# Altium schematic sheet P1.1-worcv.SchDoc
size A2
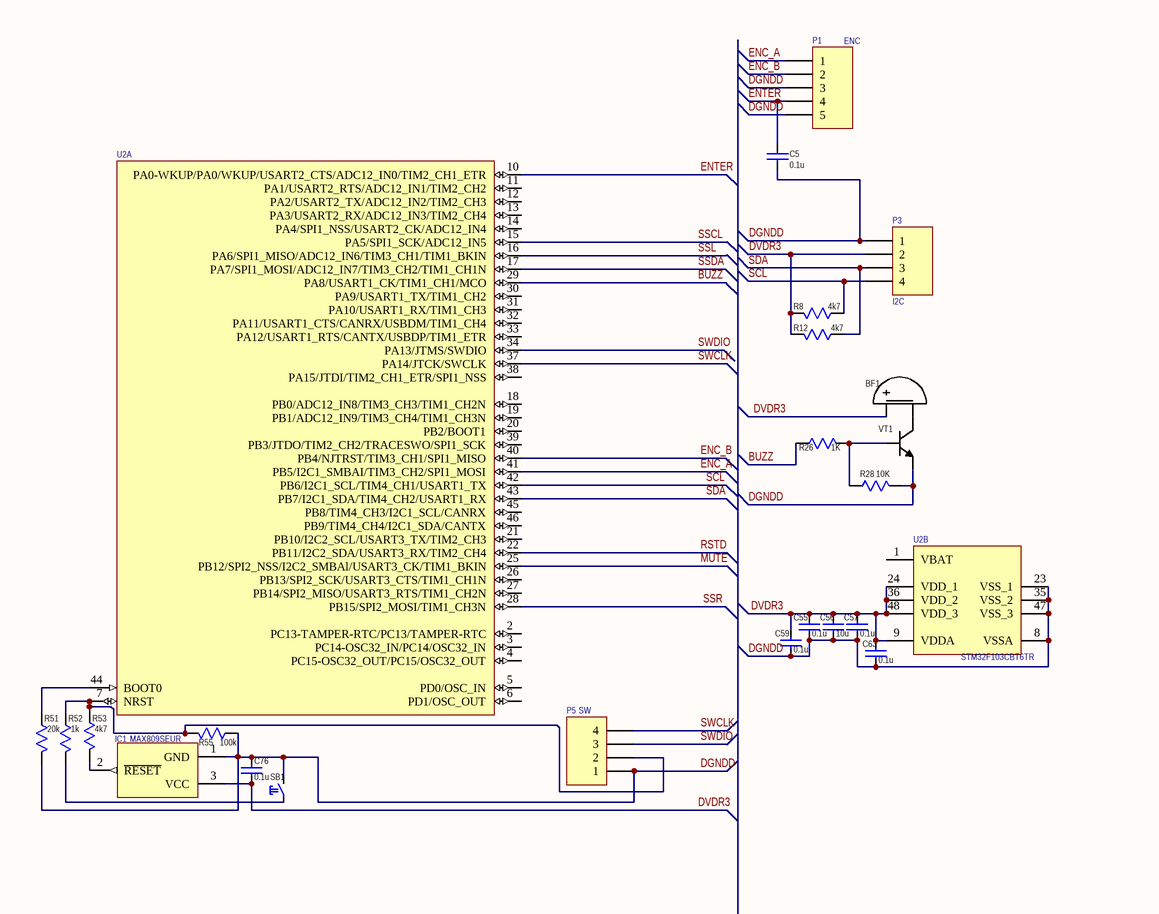
[diagram p0: P1.1-worcv.SchDoc, left]
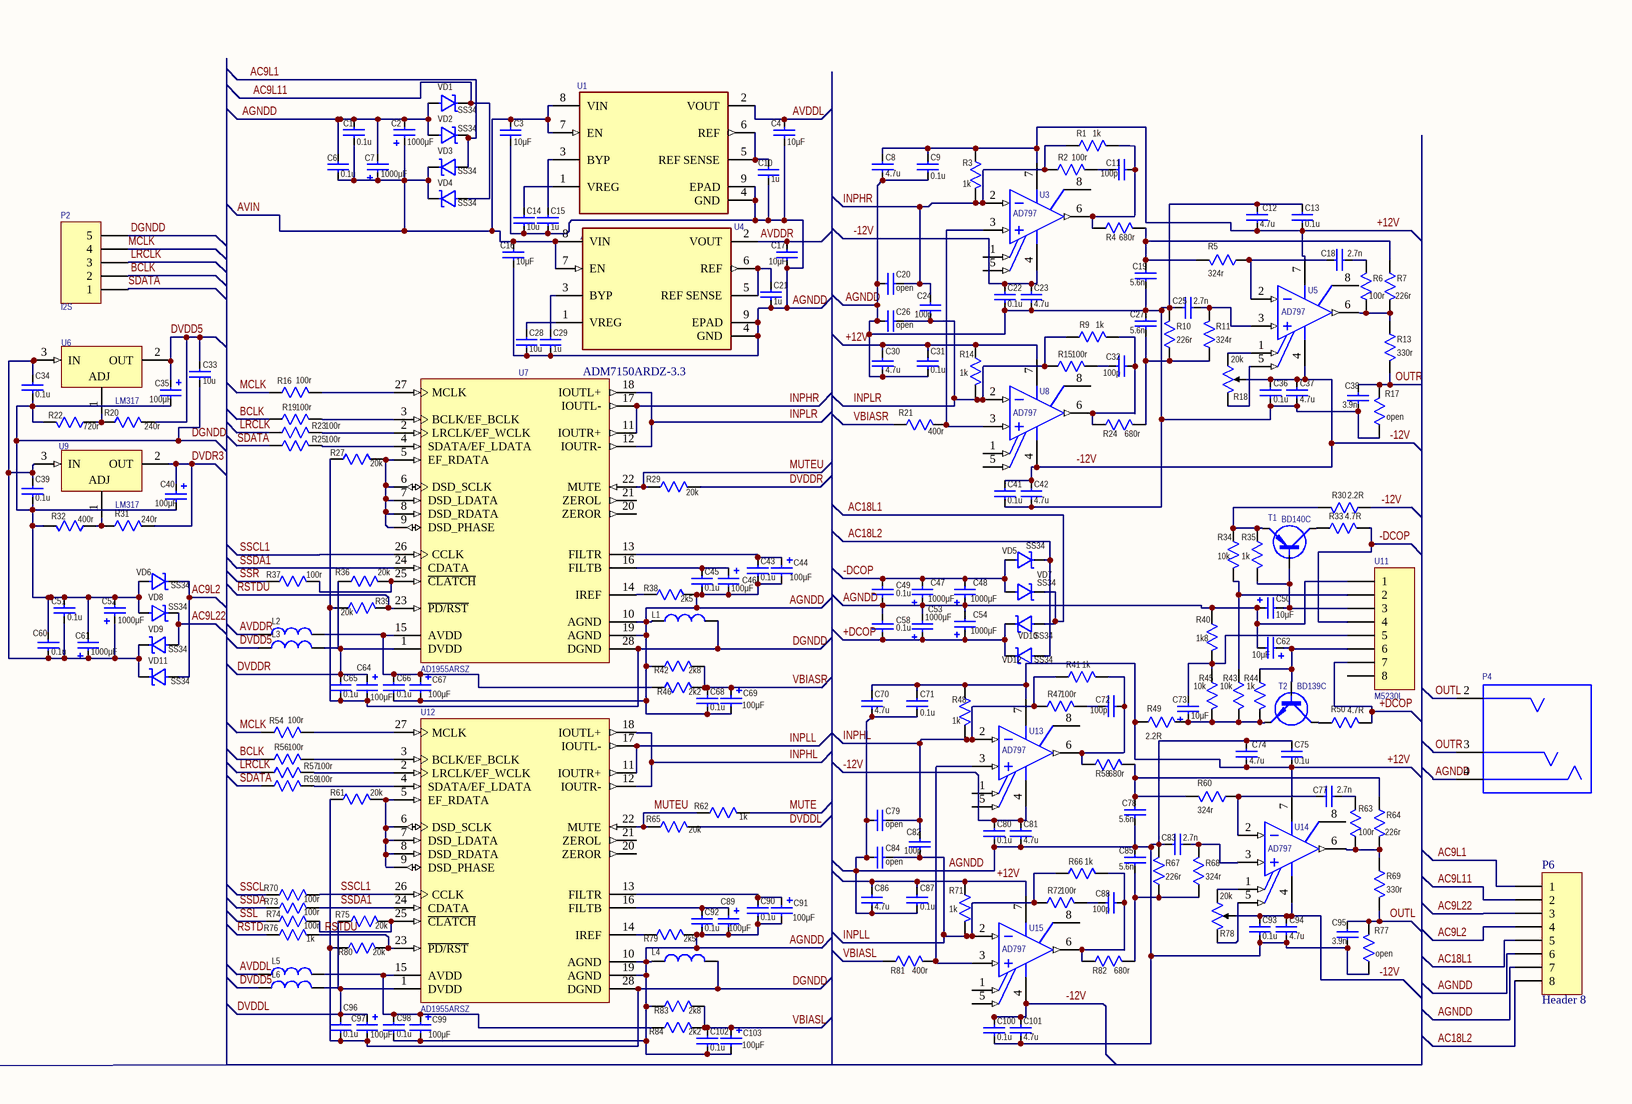
[diagram p1: P1.1-worcv.SchDoc, right]

## Parts
BF1  (no value)  [BUZ: AT-0927-TT-6-R]
C1  value 0.1u  [CAP: 0805]
C2  value 1000μF  [CAP: D10C5H20]
C3  value 10μF  [CAP: 0805]
C4  value 10μF  [CAP: 0805]
C5  value 0.1u  [CAP: 0603]
C6  value 0.1u  [CAP: 0805]
C7  value 1000μF  [CAP: D10C5H20]
C8  value 4.7u  [CAP: 0603]
C9  value 0.1u  [CAP: 0603]
C10  value 1u  [CAP: 0603]
C11  value 100p  [CAP: 0603]
C12  value 4.7u  [CAP: 0603]
C13  value 0.1u  [CAP: 0603]
C14  value 10u  [CAP: 0603]
C15  value 1u  [CAP: 0603]
C16  value 10μF  [CAP: 0805]
C17  value 10μF  [CAP: 0805]
C18  value 2.7n  [CAP: 0603]
C19  value 5.6n  [CAP: 0603]
C20  value open  [CAP: 0603]
C21  value 1u  [CAP: 0603]
C22  value 0.1u  [CAP: 0603]
C23  value 4.7u  [CAP: 0603]
C24  value 100p  [CAP: 0603]
C25  value 2.7n  [CAP: 0603]
C26  value open  [CAP: 0603]
C27  value 5.6n  [CAP: 0603]
C28  value 10u  [CAP: 0603]
C29  value 1u  [CAP: 0603]
C30  value 4.7u  [CAP: 0603]
C31  value 0.1u  [CAP: 0603]
C32  value 100p  [CAP: 0603]
C33  value 10u  [CAP: 0603]
C34  value 0.1u  [CAP: 0805]
C35  value 100μF  [CAP: D6.3C2.5H11]
C36  value 0.1u  [CAP: 0603]
C37  value 4.7u  [CAP: 0603]
C38  value 3.9n  [CAP: 0603]
C39  value 0.1u  [CAP: 0805]
C40  value 100μF  [CAP: D6.3C2.5H11]
C41  value 0.1u  [CAP: 0603]
C42  value 4.7u  [CAP: 0603]
C43  value 0.1u  [CAP: 0603]
C44  value 100μF  [CAP: D6.3C2.5H11]
C45  value 0.1u  [CAP: 0603]
C46  value 100μF  [CAP: D6.3C2.5H11]
C47  value 1000μF  [CAP: D10C5H20]
C48  value 1000μF  [CAP: D10C5H20]
C49  value 0.1u  [CAP: 0805]
C50  value 10μF  [CAP: D5C2H11]
C51  value 0.1u  [CAP: 0805]
C52  value 1000μF  [CAP: D10C5H20]
C53  value 1000μF  [CAP: D10C5H20]
C54  value 1000μF  [CAP: D10C5H20]
C55  value 0.1u  [CAP: 0603]
C56  value 10u  [CAP: 0603]
C57  value 0.1u  [CAP: 0603]
C58  value 0.1u  [CAP: 0805]
C59  value 0.1u  [CAP: 0603]
C60  value 0.1u  [CAP: 0805]
C61  value 1000μF  [CAP: D10C5H20]
C62  value 10μF  [CAP: D5C2H11]
C63  value 0.1u  [CAP: 0603]
C64  value 100μF  [CAP: D6.3C2.5H11]
C65  value 0.1u  [CAP: 0603]
C66  value 0.1u  [CAP: 0603]
C67  value 100μF  [CAP: D6.3C2.5H11]
C68  value 0.1u  [CAP: 0603]
C69  value 100μF  [CAP: D6.3C2.5H11]
C70  value 4.7u  [CAP: 0603]
C71  value 0.1u  [CAP: 0603]
C72  value 100p  [CAP: 0603]
C73  value 10μF  [CAP: D5C2H11]
C74  value 4.7u  [CAP: 0603]
C75  value 0.1u  [CAP: 0603]
C76  value 0.1u  [CAP: 0805]
C77  value 2.7n  [CAP: 0603]
C78  value 5.6n  [CAP: 0603]
C79  value open  [CAP: 0603]
C80  value 0.1u  [CAP: 0603]
C81  value 4.7u  [CAP: 0603]
C82  value 100p  [CAP: 0603]
C83  value 2.7n  [CAP: 0603]
C84  value open  [CAP: 0603]
C85  value 5.6n  [CAP: 0603]
C86  value 4.7u  [CAP: 0603]
C87  value 0.1u  [CAP: 0603]
C88  value 100p  [CAP: 0603]
C89  value 100μF  [CAP: D6.3C2.5H11]
C90  value 0.1u  [CAP: 0603]
C91  value 100μF  [CAP: D6.3C2.5H11]
C92  value 0.1u  [CAP: 0603]
C93  value 0.1u  [CAP: 0603]
C94  value 4.7u  [CAP: 0603]
C95  value 3.9n  [CAP: 0603]
C96  value 0.1u  [CAP: 0603]
C97  value 100μF  [CAP: D6.3C2.5H11]
C98  value 0.1u  [CAP: 0603]
C99  value 100μF  [CAP: D6.3C2.5H11]
C100  value 0.1u  [CAP: 0603]
C101  value 4.7u  [CAP: 0603]
C102  value 0.1u  [CAP: 0603]
C103  value 100μF  [CAP: D6.3C2.5H11]
IC1  MAX809SEUR  [SOT95P230X112-3N]
L1  (no value)  [IND: 0805]
L2  (no value)  [IND: 0805]
L3  (no value)  [IND: 0805]
L4  (no value)  [IND: 0805]
L5  (no value)  [IND: 0805]
L6  (no value)  [IND: 0805]
P1  ENC  [HDR1X5]
P2  I2S  [HDR1X5]
P3  I2C  [HDR1X4]
P4  SJ2-3573A2-SMT-TR  [CUI_SJ2-3573A2-SMT-TR]  (value not drawn)
P5  SW  [HDR1X4]
P6  Header 8  [HDR1X8]
R1  value 1k  [RES: 0603]
R2  value 100r  [RES: 0603]
R3  value 1k  [RES: 0603]
R4  value 680r  [RES: 0603]
R5  value 324r  [RES: 0603]
R6  value 100r  [RES: 0603]
R7  value 226r  [RES: 0603]
R8  value 4k7  [RES: 0603]
R9  value 1k  [RES: 0603]
R10  value 226r  [RES: 0603]
R11  value 324r  [RES: 0603]
R12  value 4k7  [RES: 0603]
R13  value 330r  [RES: 0603]
R14  value 1k  [RES: 0603]
R15  value 100r  [RES: 0603]
R16  value 100r  [RES: 0603]
R17  value open  [RES: 0603]
R18  value 20k  [RES: 3296W]
R19  value 100r  [RES: 0603]
R20  value 240r  [RES: 0603]
R21  value 400r  [RES: 0603]
R22  value 720r  [RES: 0603]
R23  value 100r  [RES: 0603]
R24  value 680r  [RES: 0603]
R25  value 100r  [RES: 0603]
R26  value 1K  [RES: 0603]
R27  value 20k  [RES: 0603]
R28  value 10K  [RES: 0603]
R29  value 20k  [RES: 0603]
R30  value 2.2R  [RES: 1206]
R31  value 240r  [RES: 0603]
R32  value 400r  [RES: 0603]
R33  value 4.7R  [RES: 1206]
R34  value 10k  [RES: 0603]
R35  value 1k  [RES: 0603]
R36  value 20k  [RES: 0603]
R37  value 100r  [RES: 0603]
R38  value 2k5  [RES: 0603]
R39  value 20k  [RES: 0603]
R40  value 1k8  [RES: 0603]
R41  value 1k  [RES: 0603]
R42  value 2k8  [RES: 0603]
R43  value 10k  [RES: 0603]
R44  value 1k  [RES: 0603]
R45  value 10k  [RES: 0603]
R46  value 2k2  [RES: 0603]
R47  value 100r  [RES: 0603]
R48  value 1k  [RES: 0603]
R49  value 2.2R  [RES: 1206]
R50  value 4.7R  [RES: 1206]
R51  value 20k  [RES: 0603]
R52  value 1k  [RES: 0603]
R53  value 4k7  [RES: 0603]
R54  value 100r  [RES: 0603]
R55  value 100k  [RES: 0603]
R56  value 100r  [RES: 0603]
R57  value 100r  [RES: 0603]
R58  value 680r  [RES: 0603]
R59  value 100r  [RES: 0603]
R60  value 324r  [RES: 0603]
R61  value 20k  [RES: 0603]
R62  value 1k  [RES: 0603]
R63  value 100r  [RES: 0603]
R64  value 226r  [RES: 0603]
R65  value 20k  [RES: 0603]
R66  value 1k  [RES: 0603]
R67  value 226r  [RES: 0603]
R68  value 324r  [RES: 0603]
R69  value 330r  [RES: 0603]
R70  value 100r  [RES: 0603]
R71  value 1k  [RES: 0603]
R72  value 100r  [RES: 0603]
R73  value 100r  [RES: 0603]
R74  value 100r  [RES: 0603]
R75  value 20k  [RES: 0603]
R76  value 1k  [RES: 0603]
R77  value open  [RES: 0603]
R78  value 20k  [RES: 3296W]
R79  value 2k5  [RES: 0603]
R80  value 20k  [RES: 0603]
R81  value 400r  [RES: 0603]
R82  value 680r  [RES: 0603]
R83  value 2k8  [RES: 0603]
R84  value 2k2  [RES: 0603]
SB1  (no value)  [BUT: 6x6 SMD]
T1  BD140C  [TO126V A]
T2  BD139C  [TO126V A]
U1  ADM7150ARDZ-3.3  [Analog_Devices_Inc_RD-8-2_0]  (value not drawn)
U2  (no value)  [QFP50P900X900X160-48N]  (parts A,B of 2)
U3  AD797  [ADI-R-8_M]
U4  ADM7150ARDZ-3.3  [Analog_Devices_Inc_RD-8-2_0]  (value not drawn)
U5  AD797  [ADI-R-8_M]
U6  LM317  [TO-220-V]
U7  AD1955ARSZ  [ADI-RS-28_L]
U8  AD797  [ADI-R-8_M]
U9  LM317  [TO-220-V]
U11  M5230L  [HDR1X8]
U12  AD1955ARSZ  [ADI-RS-28_L]
U13  AD797  [ADI-R-8_M]
U14  AD797  [ADI-R-8_M]
U15  AD797  [ADI-R-8_M]
VD1  PartNumber: SS34  [DIODE: SMA]
VD2  PartNumber: SS34  [DIODE: SMA]
VD3  PartNumber: SS34  [DIODE: SMA]
VD4  PartNumber: SS34  [DIODE: SMA]
VD5  PartNumber: SS34  [DIODE: SMA]
VD6  PartNumber: SS34  [DIODE: SMA]
VD7  PartNumber: SS34  [DIODE: SMA]
VD8  PartNumber: SS34  [DIODE: SMA]
VD9  PartNumber: SS34  [DIODE: SMA]
VD10  PartNumber: SS34  [DIODE: SMA]
VD11  PartNumber: SS34  [DIODE: SMA]
VD12  PartNumber: SS34  [DIODE: SMA]
VT1  (no value)  [SOT23]

## Nets
+12V: C8.1 C9.1 C12.2 C13.2 C30.1 C31.1 C70.1 C71.1 C74.2 C75.2 C86.1 C87.1 R3.1 R14.1 R48.1 R49.1 R71.1 U3.7(+VS) U5.7(+VS) U8.7(+VS) U13.7(+VS) U14.7(+VS) U15.7(+VS)
+DCOP: C53.1 C54.1 C58.1 R50.2 U11.7 VD10.2 VD12.2
-12V: C22.1 C23.1 C36.1 C37.1 C41.1 C42.1 C80.1 C81.1 C93.1 C94.1 C100.1 C101.1 R18.2 R30.1 R78.2 U3.4(-VS) U5.4(-VS) U8.4(-VS) U13.4(-VS) U14.4(-VS) U15.4(-VS)
-DCOP: C47.2 C48.2 C49.2 R33.2 U11.4 VD5.1 VD7.1
AC9L1: P6.1 VD2.2 VD3.1
AC9L2: P6.4 VD6.2 VD11.1
AC9L11: P6.2 VD1.2 VD4.1
AC9L22: P6.3 VD8.2 VD9.1
AC18L1: P6.5 VD7.2 VD10.1
AC18L2: P6.8 VD5.2 VD12.1
AGNDD: C1.2 C2.2 C3.2 C4.2 C6.2 C7.2 C8.2 C9.2 C10.2 C12.1 C13.1 C14.2 C15.2 C16.2 C17.2 C19.2 C20.2 C21.2 C22.2 C23.2 C25.1 C26.2 C27.1 C28.2 C29.2 C30.2 C31.2 C36.2 C37.2 C38.1 C41.2 C42.2 C43.2 C44.2 C45.2 C46.2 C47.1 C48.1 C49.1 C50.1 C53.2 C54.2 C58.2 C62.2 C66.2 C67.2 C68.2 C69.2 C70.2 C71.2 C74.1 C75.1 C78.2 C79.2 C80.2 C81.2 C83.1 C84.2 C85.1 C86.2 C87.2 C89.2 C90.2 C91.2 C92.2 C93.2 C94.2 C95.1 C98.2 C99.2 C100.2 C101.2 C102.2 C103.2 L1.2 L4.2 P4.4(RING2) P6.6 P6.7 R10.2 R17.1 R38.2 R40.1 R42.1 R67.2 R77.1 R79.2 R83.1 U1.4(GND) U1.9(EPAD) U4.4(GND) U4.9(EPAD) U7.10(AGND) U7.19(AGND) U11.1 U12.10(AGND) U12.19(AGND) VD1.1 VD2.1
AVDDL: C4.1 L5.2 U1.2(VOUT)
AVDDR: C17.1 L2.2 U4.2(VOUT)
AVIN: C1.1 C2.1 C3.1 C6.1 C7.1 C16.1 U1.7(EN) U1.8(VIN) U4.7(EN) U4.8(VIN) VD3.2 VD4.2
BCLK: P2.2 R19.1 R56.1
BUZZ: R26.1 U2.29(PA8/USART1_CK/TIM1_CH1/MCO)
DGNDD: C5.2 C33.2 C34.1 C35.2 C39.1 C40.2 C51.2 C52.2 C55.1 C56.2 C57.1 C59.1 C60.2 C61.2 C63.1 C64.2 C65.2 C76.2 C96.2 C97.2 IC1.1(GND) L1.1 L4.1 P1.3 P1.5 P2.5 P3.1 P5.1 R22.2 R27.1 R28.2 R32.2 R39.1 R51.2 R55.1 R61.1 R80.1 SB1.2 U2.8(VSSA) U2.23(VSS_1) U2.35(VSS_2) U2.47(VSS_3) U7.28(DGND) U12.28(DGND) VD6.1 VD8.1 VT1.2(E)
DVDD5: C33.1 C35.1 L3.2 L6.2 R20.2 U6.2(OUT)
DVDDL: C96.1 C97.1 L6.1 R65.2 R75.1 U12.1(DVDD)
DVDDR: C64.1 C65.1 L3.1 R29.2 R36.1 U7.1(DVDD)
DVDR3: BF1.1(+) C40.1 C55.2 C56.1 C57.2 C59.2 C63.2 C76.1 IC1.3(VCC) P3.2 R8.2 R12.2 R31.2 U2.9(VDDA) U2.24(VDD_1) U2.36(VDD_2) U2.48(VDD_3) U9.2(OUT)
ENC_A: P1.1 U2.41(PB5/I2C1_SMBAI/TIM3_CH2/SPI1_MOSI)
ENC_B: P1.2 U2.40(PB4/NJTRST/TIM3_CH1/SPI1_MISO)
ENTER: C5.1 P1.4 U2.10(PA0-WKUP/PA0/WKUP/USART2_CTS/ADC12_IN0/TIM2_CH1_ETR)
INPHL: C79.1 C82.2 R41.1 R47.1 R48.2 U12.12(IOUTR-) U12.18(IOUTL+) U13.2(-IN)
INPHR: C20.1 C24.2 R1.1 R2.1 R3.2 U3.2(-IN) U7.11(IOUTR+) U7.17(IOUTL-)
INPLL: C82.1 C84.1 R66.1 R71.2 R72.1 U12.11(IOUTR+) U12.17(IOUTL-) U15.2(-IN)
INPLR: C24.1 C26.1 R9.1 R14.2 R15.1 U7.12(IOUTR-) U7.18(IOUTL+) U8.2(-IN)
LRCLK: P2.3 R23.1 R57.1
MCLK: P2.4 R16.1 R54.1
MUTE: R62.2 U2.25(PB12/SPI2_NSS/I2C2_SMBAl/USART3_CK/TIM1_BKIN)
MUTEU: R29.1 R62.1 R65.1 U7.22(MUTE) U12.22(MUTE)
OUTL: C95.2 P4.2(TIP) R69.2 R77.2
OUTR: C38.2 P4.3(RING1) R13.2 R17.2
RSTD: R76.1 U2.22(PB11/I2C2_SDA/USART3_RX/TIM2_CH4)
RSTDU: R39.2 R76.2 R80.2 U7.23(~{PD/RST}) U12.23(~{PD/RST})
SCL: P3.4 R8.1 U2.42(PB6/I2C1_SCL/TIM4_CH1/USART1_TX)
SDA: P3.3 R12.1 U2.43(PB7/I2C1_SDA/TIM4_CH2/USART1_RX)
SDATA: P2.1 R25.1 R59.1
SSCL: R70.1 U2.15(PA5/SPI1_SCK/ADC12_IN5)
SSCL1: R70.2 U7.26(CCLK) U12.26(CCLK)
SSDA: R73.1 U2.17(PA7/SPI1_MOSI/ADC12_IN7/TIM3_CH2/TIM1_CH1N)
SSDA1: R73.2 U7.24(CDATA) U12.24(CDATA)
SSL: R74.1 U2.16(PA6/SPI1_MISO/ADC12_IN6/TIM3_CH1/TIM1_BKIN)
SSR: R37.1 U2.28(PB15/SPI2_MOSI/TIM1_CH3N)
SWCLK: P5.4 U2.37(PA14/JTCK/SWCLK)
SWDIO: P5.3 U2.34(PA13/JTMS/SWDIO)
VBIASL: C102.1 C103.1 R81.1 R83.2 R84.2
VBIASR: C68.1 C69.1 R21.1 R42.2 R46.2
NetBF1_2: BF1.2(-) VT1.3(C)
NetC10_1: C10.1 U1.5(REF_SENSE) U1.6(REF)
NetC11_1: C11.1 R1.2 R4.1 U3.6(OUT)
NetC11_2: C11.2 R2.2
NetC14_1: C14.1 U1.1(VREG)
NetC15_1: C15.1 U1.3(BYP)
NetC18_1: C18.1 R5.1 U5.2(-IN)
NetC18_2: C18.2 R6.2
NetC19_1: C19.1 R4.2 R5.2 R7.1
NetC21_1: C21.1 U4.5(REF_SENSE) U4.6(REF)
NetC25_2: C25.2 R11.2 U5.3(+IN)
NetC27_2: C27.2 R10.1 R11.1 R24.2
NetC28_1: C28.1 U4.1(VREG)
NetC29_1: C29.1 U4.3(BYP)
NetC32_1: C32.1 R9.2 R24.1 U8.6(OUT)
NetC32_2: C32.2 R15.2
NetC34_2: C34.2 C39.2 C51.1 C52.1 C60.1 C61.1 U6.3(IN) U9.3(IN) VD9.2 VD11.2
NetC43_1: C43.1 C44.1 U7.13(FILTR)
NetC45_1: C45.1 C46.1 U7.16(FILTB)
NetC50_2: C50.2 R35.2 T1.3(B) U11.3
NetC62_1: C62.1 R44.1 T2.3(B) U11.6
NetC66_1: C66.1 C67.1 L2.1 R46.1 U7.15(AVDD)
NetC72_1: C72.1 R41.2 R58.1 U13.6(OUT)
NetC72_2: C72.2 R47.2
NetC73_1: C73.1 R43.2 R44.2 R45.2 R49.2 T2.1(E)
NetC73_2: C73.2 R40.2 R45.1 U11.5
NetC77_1: C77.1 R60.1 U14.2(-IN)
NetC77_2: C77.2 R63.2
NetC78_1: C78.1 R58.2 R60.2 R64.1
NetC83_2: C83.2 R68.2 U14.3(+IN)
NetC85_2: C85.2 R67.1 R68.1 R82.2
NetC88_1: C88.1 R66.2 R82.1 U15.6(OUT)
NetC88_2: C88.2 R72.2
NetC89_1: C89.1 C92.1 U12.16(FILTB)
NetC90_1: C90.1 C91.1 U12.13(FILTR)
NetC98_1: C98.1 C99.1 L5.1 R84.1 U12.15(AVDD)
NetIC1_2: IC1.2(~{RESET}) R53.2
NetP5_2: P5.2 R52.1 R53.1 R55.2 U2.7(NRST)
NetR6_1: R6.1 R7.2 R13.1 U5.6(OUT)
NetR16_2: R16.2 U7.27(MCLK)
NetR18_1: R18.1 U5.1(OFFSET_NULL)
NetR18_3: R18.3 U5.5(OFFSET_NULL)
NetR19_2: R19.2 U7.3(BCLK/EF_BCLK)
NetR20_1: R20.1 R22.1 U6.1(ADJ)
NetR21_2: R21.2 U3.3(+IN) U8.3(+IN)
NetR23_2: R23.2 U7.2(LRCLK/EF_WCLK)
NetR25_2: R25.2 U7.4(SDATA/EF_LDATA)
NetR26_2: R26.2 R28.1 VT1.1(B)
NetR27_2: R27.2 U7.5(EF_RDATA) U7.6(DSD_SCLK) U7.7(DSD_LDATA) U7.8(DSD_RDATA) U7.9(DSD_PHASE)
NetR30_2: R30.2 R34.1 R35.1 T1.1(E)
NetR31_1: R31.1 R32.1 U9.1(ADJ)
NetR33_1: R33.1 T1.2(C)
NetR34_2: R34.2 R43.1 U11.2
NetR36_2: R36.2 R37.2 U7.25(~{CLATCH})
NetR38_1: R38.1 U7.14(IREF)
NetR50_1: R50.1 T2.2(C)
NetR51_1: R51.1 U2.44(BOOT0)
NetR52_2: R52.2 SB1.1
NetR54_2: R54.2 U12.27(MCLK)
NetR56_2: R56.2 U12.3(BCLK/EF_BCLK)
NetR57_2: R57.2 U12.2(LRCLK/EF_WCLK)
NetR59_2: R59.2 U12.4(SDATA/EF_LDATA)
NetR61_2: R61.2 U12.5(EF_RDATA) U12.6(DSD_SCLK) U12.7(DSD_LDATA) U12.8(DSD_RDATA) U12.9(DSD_PHASE)
NetR63_1: R63.1 R64.2 R69.1 U14.6(OUT)
NetR74_2: R74.2 R75.2 U12.25(~{CLATCH})
NetR78_1: R78.1 U14.1(OFFSET_NULL)
NetR78_3: R78.3 U14.5(OFFSET_NULL)
NetR79_1: R79.1 U12.14(IREF)
NetR81_2: R81.2 U13.3(+IN) U15.3(+IN)

Not connected (* = marked no-connect by the designer): U2 1(VBAT) 2(PC13-TAMPER-RTC/PC13/TAMPER-RTC) 3(PC14-OSC32_IN/PC14/OSC32_IN) 4(PC15-OSC32_OUT/PC15/OSC32_OUT) 5(PD0/OSC_IN) 6(PD1/OSC_OUT) 11(PA1/USART2_RTS/ADC12_IN1/TIM2_CH2) 12(PA2/USART2_TX/ADC12_IN2/TIM2_CH3) 13(PA3/USART2_RX/ADC12_IN3/TIM2_CH4) 14(PA4/SPI1_NSS/USART2_CK/ADC12_IN4) 18(PB0/ADC12_IN8/TIM3_CH3/TIM1_CH2N) 19(PB1/ADC12_IN9/TIM3_CH4/TIM1_CH3N) 20(PB2/BOOT1) 21(PB10/I2C2_SCL/USART3_TX/TIM2_CH3) 26(PB13/SPI2_SCK/USART3_CTS/TIM1_CH1N) 27(PB14/SPI2_MISO/USART3_RTS/TIM1_CH2N) 30(PA9/USART1_TX/TIM1_CH2) 31(PA10/USART1_RX/TIM1_CH3) 32(PA11/USART1_CTS/CANRX/USBDM/TIM1_CH4) 33(PA12/USART1_RTS/CANTX/USBDP/TIM1_ETR) 38(PA15/JTDI/TIM2_CH1_ETR/SPI1_NSS) 39(PB3/JTDO/TIM2_CH2/TRACESWO/SPI1_SCK) 45(PB8/TIM4_CH3/I2C1_SCL/CANRX) 46(PB9/TIM4_CH4/I2C1_SDA/CANTX); U3 1(OFFSET_NULL) 5(OFFSET_NULL) 8(DECOMPENSATION_AND_DISTORTION_NEUTRALIZATION); U5 8(DECOMPENSATION_AND_DISTORTION_NEUTRALIZATION); U7 20(ZEROR) 21(ZEROL); U8 1(OFFSET_NULL) 5(OFFSET_NULL) 8(DECOMPENSATION_AND_DISTORTION_NEUTRALIZATION); U11 8; U12 20(ZEROR) 21(ZEROL); U13 1(OFFSET_NULL) 5(OFFSET_NULL) 8(DECOMPENSATION_AND_DISTORTION_NEUTRALIZATION); U14 8(DECOMPENSATION_AND_DISTORTION_NEUTRALIZATION); U15 1(OFFSET_NULL) 5(OFFSET_NULL) 8(DECOMPENSATION_AND_DISTORTION_NEUTRALIZATION)

## Library data of the parts
BF1 = Buzzer: Manufacturer: PUI Audio; ValueManufacturerPartNumber: DIP switch, 2.73 kHz, 3VDC, 80mA, -20...+70°C; PartNumber: AT-0927-TT-6-R; TypeBuzzer: DIP switch; VoltageMax: 3VDC; Frequency: 2.73 kHz; CurrentMax: 80mA; HelpURL: https://www.digikey.com/products/en?keywords=AT-0927-TT-6-R; Temperature: -20...+70°C
C1 C5 C6 C9 C13 C22 C31 C34 C36 C39 C41 C43 C45 C49 C51 C55 C57-C60 C63 C65 C66 C68 C71 C75 C76 C80 C87 C90 C92 C93 C96 C98 C100 C102 = Ceramic: Manufacturer: Yageo; PartNumber: CC0201KRX7R7BB103; ValueManufacturerPartNumber: Ceramic capacitor, 0.1u, X7R, ±10%, 16V, 0201, -55...+125°C; TypeCapacitor: Ceramic capacitor; Tolerance: ±10%; TypeDielectric: X7R; Voltage: 16V; Package: 0201; HelpURL: https://www.digikey.com/product-detail/en/yageo/CC0201KRX7R7BB103/311-1404-1-ND/2833710; Temperature: -55...+125°C
C2 C7 C47 C48 C52-C54 C61 = Aluminium: Manufacturer: Wurth; PartNumber: 860080475013; ValueManufacturerPartNumber: Aluminium capacitor, 1000μF, 35V, ±20%, 54mOhm, 14x10x5 mm, -55...+105°C; TypeCapacitor: Aluminium capacitor; Tolerance: ±20%; Impedance: 54mOhm; Voltage: 35V; Package: 14x10x5 mm; HelpURL: https://www.digikey.com/product-detail/en/wurth-electronics-inc/860080475013/732-9029-1-ND/5728972; Temperature: -55...+105°C
C3 C4 C16 C17 = Ceramic: Manufacturer: Yageo; PartNumber: CC0201KRX7R7BB103; ValueManufacturerPartNumber: Ceramic capacitor, 10μF, X7R, ±10%, 16V, 0201, -55...+125°C; TypeCapacitor: Ceramic capacitor; Tolerance: ±10%; TypeDielectric: X7R; Voltage: 16V; Package: 0201; HelpURL: https://www.digikey.com/product-detail/en/yageo/CC0201KRX7R7BB103/311-1404-1-ND/2833710; Temperature: -55...+125°C
C8 C12 C23 C30 C37 C42 C70 C74 C81 C86 C94 C101 = Ceramic: Manufacturer: Yageo; PartNumber: CC0201KRX7R7BB103; ValueManufacturerPartNumber: Ceramic capacitor, 4.7u, X7R, ±10%, 16V, 0201, -55...+125°C; TypeCapacitor: Ceramic capacitor; Tolerance: ±10%; TypeDielectric: X7R; Voltage: 16V; Package: 0201; HelpURL: https://www.digikey.com/product-detail/en/yageo/CC0201KRX7R7BB103/311-1404-1-ND/2833710; Temperature: -55...+125°C
C10 C15 C21 C29 = Ceramic: Manufacturer: Yageo; PartNumber: CC0201KRX7R7BB103; ValueManufacturerPartNumber: Ceramic capacitor, 1u, X7R, ±10%, 16V, 0201, -55...+125°C; TypeCapacitor: Ceramic capacitor; Tolerance: ±10%; TypeDielectric: X7R; Voltage: 16V; Package: 0201; HelpURL: https://www.digikey.com/product-detail/en/yageo/CC0201KRX7R7BB103/311-1404-1-ND/2833710; Temperature: -55...+125°C
C11 C24 C32 C72 C82 C88 = Ceramic: Manufacturer: Yageo; PartNumber: CC0201KRX7R7BB103; ValueManufacturerPartNumber: Ceramic capacitor, 100p, X7R, ±10%, 16V, 0201, -55...+125°C; TypeCapacitor: Ceramic capacitor; Tolerance: ±10%; TypeDielectric: X7R; Voltage: 16V; Package: 0201; HelpURL: https://www.digikey.com/product-detail/en/yageo/CC0201KRX7R7BB103/311-1404-1-ND/2833710; Temperature: -55...+125°C
C14 C28 C33 C56 = Ceramic: Manufacturer: Yageo; PartNumber: CC0201KRX7R7BB103; ValueManufacturerPartNumber: Ceramic capacitor, 10u, X7R, ±10%, 16V, 0201, -55...+125°C; TypeCapacitor: Ceramic capacitor; Tolerance: ±10%; TypeDielectric: X7R; Voltage: 16V; Package: 0201; HelpURL: https://www.digikey.com/product-detail/en/yageo/CC0201KRX7R7BB103/311-1404-1-ND/2833710; Temperature: -55...+125°C
C18 C25 C77 C83 = Ceramic: Manufacturer: Yageo; PartNumber: CC0201KRX7R7BB103; ValueManufacturerPartNumber: Ceramic capacitor, 2.7n, X7R, ±10%, 16V, 0201, -55...+125°C; TypeCapacitor: Ceramic capacitor; Tolerance: ±10%; TypeDielectric: X7R; Voltage: 16V; Package: 0201; HelpURL: https://www.digikey.com/product-detail/en/yageo/CC0201KRX7R7BB103/311-1404-1-ND/2833710; Temperature: -55...+125°C
C19 C27 C78 C85 = Ceramic: Manufacturer: Yageo; PartNumber: CC0201KRX7R7BB103; ValueManufacturerPartNumber: Ceramic capacitor, 5.6n, X7R, ±10%, 16V, 0201, -55...+125°C; TypeCapacitor: Ceramic capacitor; Tolerance: ±10%; TypeDielectric: X7R; Voltage: 16V; Package: 0201; HelpURL: https://www.digikey.com/product-detail/en/yageo/CC0201KRX7R7BB103/311-1404-1-ND/2833710; Temperature: -55...+125°C
C20 C26 C79 C84 = Ceramic: Manufacturer: Yageo; PartNumber: CC0201KRX7R7BB103; ValueManufacturerPartNumber: Ceramic capacitor, open, X7R, ±10%, 16V, 0201, -55...+125°C; TypeCapacitor: Ceramic capacitor; Tolerance: ±10%; TypeDielectric: X7R; Voltage: 16V; Package: 0201; HelpURL: https://www.digikey.com/product-detail/en/yageo/CC0201KRX7R7BB103/311-1404-1-ND/2833710; Temperature: -55...+125°C
C35 C40 C44 C46 C64 C67 C69 C89 C91 C97 C99 C103 = Aluminium: Manufacturer: Wurth; PartNumber: 860080475013; ValueManufacturerPartNumber: Aluminium capacitor, 100μF, 25V, ±20%, 54mOhm, 14x10x5 mm, -55...+105°C; TypeCapacitor: Aluminium capacitor; Tolerance: ±20%; Impedance: 54mOhm; Voltage: 25V; Package: 14x10x5 mm; HelpURL: https://www.digikey.com/product-detail/en/wurth-electronics-inc/860080475013/732-9029-1-ND/5728972; Temperature: -55...+105°C
C38 C95 = Ceramic: Manufacturer: Yageo; PartNumber: CC0201KRX7R7BB103; ValueManufacturerPartNumber: Ceramic capacitor, 3.9n, X7R, ±10%, 16V, 0201, -55...+125°C; TypeCapacitor: Ceramic capacitor; Tolerance: ±10%; TypeDielectric: X7R; Voltage: 16V; Package: 0201; HelpURL: https://www.digikey.com/product-detail/en/yageo/CC0201KRX7R7BB103/311-1404-1-ND/2833710; Temperature: -55...+125°C
C50 C62 C73 = Aluminium: Manufacturer: Wurth; PartNumber: 860080475013; ValueManufacturerPartNumber: Aluminium capacitor, 10μF, 50V, ±20%, 54mOhm, 14x10x5 mm, -55...+105°C; TypeCapacitor: Aluminium capacitor; Tolerance: ±20%; Impedance: 54mOhm; Voltage: 50V; Package: 14x10x5 mm; HelpURL: https://www.digikey.com/product-detail/en/wurth-electronics-inc/860080475013/732-9029-1-ND/5728972; Temperature: -55...+105°C
IC1 = MAX809MEUR: 3-Pin Microprocessor Reset Circuit; Part Description: 3-Pin Microprocessor Reset Circuit (Reset Threshold 4.38V); Manufacturer: MAXIM; PressFit: No; Bonding: No; Part Number: MAX809SEUR; Component Kind: Standard; Component Type: Standard; Device: MAX809SEUR; PackageDescription: SOT23 3-Leads, Pitch 0.95mm - Body 1.3x2.86mm, IPC Medium Density; Manufacturer Part Number: MAX809SEUR; Pin Count: 3; Case: SOT23; Mounted: Yes; Socket: No; SMD: Yes; Sense: No; ComponentHeight: 1.12mm; HelpURL: \\cern.ch\dfs\Applications\Altium\Datasheets\MAX809MEUR.pdf; Author: CERN DEM JLC; CreateDate: 23.08.2012; LatestRevisionDate: 23.08.2012
L1-L6 = Inductor_SMD: Manufacturer: Murata Electronics; PartNumber: LQP03TNR10J02D; ValueManufacturerPartNumber: Fixed inductor, 100nH, ±5%, 0201, 80mA, -55...+125°C; TypeInductor: Fixed inductor; MaxCurrent: 80mA; Tolerance: ±5%; Value: 100nH; Package: 0201; HelpURL: https://www.digikey.com/product-detail/en/murata-electronics-north-america/LQP03TNR10J02D/490-6742-1-ND/3845939; Temperature: -55...+125°C
P1 P2 = Header 5: Header, 5-Pin; LatestRevisionDate: 17-Jul-2002; LatestRevisionNote: Re-released for DXP Platform.; Publisher: Altium Limited
P3 P5 = Header 4: Header, 4-Pin; LatestRevisionDate: 17-Jul-2002; LatestRevisionNote: Re-released for DXP Platform.; Publisher: Altium Limited
P4 = SJ2-3573A2-SMT-TR: 3.5 mm, Stereo, Right Angle, Surface Mount _SMT_, Audio Jack Connector; MF: CUI Devices; Value: *; MP: SJ2-3573A2-SMT-TR; SnapEDA_Link: https://www.snapeda.com/parts/SJ2-3573A2-SMT-TR/CUI%20Devices/view-part/701785/?ref=snap; Package: None; Digi-Key_Part_Number: CP-SJ2-3573A2-SMT-CT-ND; Digi-Key_Purchase_URL: https://www.digikey.com.tr/product-detail/en/cui-devices/SJ2-3573A2-SMT-TR/CP-SJ2-3573A2-SMT-CT-ND/6619610?utm_source=snapeda&utm_medium=aggregator&utm_campaign=symbol; CUI_purchase_URL: https://www.cuidevices.com/product/interconnect/connectors/audio-connectors/jacks/sj2-357x-smt-series?utm_source=snapeda.com&utm_medium=referral&utm_campaign=snapedaBOM
P6 U11 = Header 8: Header, 8-Pin; LatestRevisionDate: 17-Jul-2002; LatestRevisionNote: Re-released for DXP Platform.; Publisher: Altium Limited
R1 R3 R9 R14 R35 R41 R44 R48 R52 R62 R66 R71 R76 = Resistor: Manufacturer: Yageo; PartNumber: RC0201JR-07100RL; ValueManufacturerPartNumber: Resistor film, 1k, ±5%, 0201, 0.05W, -55...+125°C; TypeResistor: Resistor film; Power: 0.05W; Tolerance: ±5%; Package: 0201; HelpURL: https://www.digikey.com/product-detail/en/yageo/RC0201JR-07100RL/311-100NCT-ND/1949006; Temperature: -55...+125°C
R2 R6 R15 R16 R19 R23 R25 R37 R47 R54 R56 R57 R59 R63 R70 R72-R74 = Resistor: Manufacturer: Yageo; PartNumber: RC0201JR-07100RL; ValueManufacturerPartNumber: Resistor film, 100r, ±5%, 0201, 0.05W, -55...+125°C; TypeResistor: Resistor film; Power: 0.05W; Tolerance: ±5%; Package: 0201; HelpURL: https://www.digikey.com/product-detail/en/yageo/RC0201JR-07100RL/311-100NCT-ND/1949006; Temperature: -55...+125°C
R4 R24 R58 R82 = Resistor: Manufacturer: Yageo; PartNumber: RC0201JR-07100RL; ValueManufacturerPartNumber: Resistor film, 680r, ±5%, 0201, 0.05W, -55...+125°C; TypeResistor: Resistor film; Power: 0.05W; Tolerance: ±5%; Package: 0201; HelpURL: https://www.digikey.com/product-detail/en/yageo/RC0201JR-07100RL/311-100NCT-ND/1949006; Temperature: -55...+125°C
R5 R11 R60 R68 = Resistor: Manufacturer: Yageo; PartNumber: RC0201JR-07100RL; ValueManufacturerPartNumber: Resistor film, 324r, ±5%, 0201, 0.05W, -55...+125°C; TypeResistor: Resistor film; Power: 0.05W; Tolerance: ±5%; Package: 0201; HelpURL: https://www.digikey.com/product-detail/en/yageo/RC0201JR-07100RL/311-100NCT-ND/1949006; Temperature: -55...+125°C
R7 R10 R64 R67 = Resistor: Manufacturer: Yageo; PartNumber: RC0201JR-07100RL; ValueManufacturerPartNumber: Resistor film, 226r, ±5%, 0201, 0.05W, -55...+125°C; TypeResistor: Resistor film; Power: 0.05W; Tolerance: ±5%; Package: 0201; HelpURL: https://www.digikey.com/product-detail/en/yageo/RC0201JR-07100RL/311-100NCT-ND/1949006; Temperature: -55...+125°C
R8 R12 R53 = Resistor: Manufacturer: Yageo; PartNumber: RC0201JR-07100RL; ValueManufacturerPartNumber: Resistor film, 4k7, ±5%, 0201, 0.05W, -55...+125°C; TypeResistor: Resistor film; Power: 0.05W; Tolerance: ±5%; Package: 0201; HelpURL: https://www.digikey.com/product-detail/en/yageo/RC0201JR-07100RL/311-100NCT-ND/1949006; Temperature: -55...+125°C
R13 R69 = Resistor: Manufacturer: Yageo; PartNumber: RC0201JR-07100RL; ValueManufacturerPartNumber: Resistor film, 330r, ±5%, 0201, 0.05W, -55...+125°C; TypeResistor: Resistor film; Power: 0.05W; Tolerance: ±5%; Package: 0201; HelpURL: https://www.digikey.com/product-detail/en/yageo/RC0201JR-07100RL/311-100NCT-ND/1949006; Temperature: -55...+125°C
R17 R77 = Resistor: Manufacturer: Yageo; PartNumber: RC0201JR-07100RL; ValueManufacturerPartNumber: Resistor film, open, ±5%, 0201, 0.05W, -55...+125°C; TypeResistor: Resistor film; Power: 0.05W; Tolerance: ±5%; Package: 0201; HelpURL: https://www.digikey.com/product-detail/en/yageo/RC0201JR-07100RL/311-100NCT-ND/1949006; Temperature: -55...+125°C
R18 R78 = Trimmer: Manufacturer: Bourns; PartNumber: 3296W-1-103LF; ValueManufacturerPartNumber: Resistor film, 20k, ±10%, 3296W, 0.5W, -55...+125°C; TypeResistor: Resistor film; Power: 0.5W; Tolerance: ±10%; Package: 3296W; HelpURL: https://www.digikey.com/product-detail/en/bourns-inc/3296W-1-103LF/3296W-103LF-ND/1088045; Temperature: -55...+125°C
R20 R31 = Resistor: Manufacturer: Yageo; PartNumber: RC0201JR-07100RL; ValueManufacturerPartNumber: Resistor film, 240r, ±5%, 0201, 0.05W, -55...+125°C; TypeResistor: Resistor film; Power: 0.05W; Tolerance: ±5%; Package: 0201; HelpURL: https://www.digikey.com/product-detail/en/yageo/RC0201JR-07100RL/311-100NCT-ND/1949006; Temperature: -55...+125°C
R21 R32 R81 = Resistor: Manufacturer: Yageo; PartNumber: RC0201JR-07100RL; ValueManufacturerPartNumber: Resistor film, 400r, ±5%, 0201, 0.05W, -55...+125°C; TypeResistor: Resistor film; Power: 0.05W; Tolerance: ±5%; Package: 0201; HelpURL: https://www.digikey.com/product-detail/en/yageo/RC0201JR-07100RL/311-100NCT-ND/1949006; Temperature: -55...+125°C
R22 = Resistor: Manufacturer: Yageo; PartNumber: RC0201JR-07100RL; ValueManufacturerPartNumber: Resistor film, 720r, ±5%, 0201, 0.05W, -55...+125°C; TypeResistor: Resistor film; Power: 0.05W; Tolerance: ±5%; Package: 0201; HelpURL: https://www.digikey.com/product-detail/en/yageo/RC0201JR-07100RL/311-100NCT-ND/1949006; Temperature: -55...+125°C
R26 = Resistor: Manufacturer: Yageo; PartNumber: RC0201JR-07100RL; ValueManufacturerPartNumber: Resistor film, 1K, ±5%, 0201, 0.05W, -55...+125°C; TypeResistor: Resistor film; Power: 0.05W; Tolerance: ±5%; Package: 0201; HelpURL: https://www.digikey.com/product-detail/en/yageo/RC0201JR-07100RL/311-100NCT-ND/1949006; Temperature: -55...+125°C
R27 R29 R36 R39 R51 R61 R65 R75 R80 = Resistor: Manufacturer: Yageo; PartNumber: RC0201JR-07100RL; ValueManufacturerPartNumber: Resistor film, 20k, ±5%, 0201, 0.05W, -55...+125°C; TypeResistor: Resistor film; Power: 0.05W; Tolerance: ±5%; Package: 0201; HelpURL: https://www.digikey.com/product-detail/en/yageo/RC0201JR-07100RL/311-100NCT-ND/1949006; Temperature: -55...+125°C
R28 = Resistor: Manufacturer: Yageo; PartNumber: RC0201JR-07100RL; ValueManufacturerPartNumber: Resistor film, 10K, ±5%, 0201, 0.05W, -55...+125°C; TypeResistor: Resistor film; Power: 0.05W; Tolerance: ±5%; Package: 0201; HelpURL: https://www.digikey.com/product-detail/en/yageo/RC0201JR-07100RL/311-100NCT-ND/1949006; Temperature: -55...+125°C
R30 R49 = Resistor: Manufacturer: Yageo; PartNumber: RC0201JR-07100RL; ValueManufacturerPartNumber: Resistor film, 2.2R, ±5%, 0201, 0.05W, -55...+125°C; TypeResistor: Resistor film; Power: 0.05W; Tolerance: ±5%; Package: 0201; HelpURL: https://www.digikey.com/product-detail/en/yageo/RC0201JR-07100RL/311-100NCT-ND/1949006; Temperature: -55...+125°C
R33 R50 = Resistor: Manufacturer: Yageo; PartNumber: RC0201JR-07100RL; ValueManufacturerPartNumber: Resistor film, 4.7R, ±5%, 0201, 0.05W, -55...+125°C; TypeResistor: Resistor film; Power: 0.05W; Tolerance: ±5%; Package: 0201; HelpURL: https://www.digikey.com/product-detail/en/yageo/RC0201JR-07100RL/311-100NCT-ND/1949006; Temperature: -55...+125°C
R34 R43 R45 = Resistor: Manufacturer: Yageo; PartNumber: RC0201JR-07100RL; ValueManufacturerPartNumber: Resistor film, 10k, ±5%, 0201, 0.05W, -55...+125°C; TypeResistor: Resistor film; Power: 0.05W; Tolerance: ±5%; Package: 0201; HelpURL: https://www.digikey.com/product-detail/en/yageo/RC0201JR-07100RL/311-100NCT-ND/1949006; Temperature: -55...+125°C
R38 R79 = Resistor: Manufacturer: Yageo; PartNumber: RC0201JR-07100RL; ValueManufacturerPartNumber: Resistor film, 2k5, ±5%, 0201, 0.05W, -55...+125°C; TypeResistor: Resistor film; Power: 0.05W; Tolerance: ±5%; Package: 0201; HelpURL: https://www.digikey.com/product-detail/en/yageo/RC0201JR-07100RL/311-100NCT-ND/1949006; Temperature: -55...+125°C
R40 = Resistor: Manufacturer: Yageo; PartNumber: RC0201JR-07100RL; ValueManufacturerPartNumber: Resistor film, 1k8, ±5%, 0201, 0.05W, -55...+125°C; TypeResistor: Resistor film; Power: 0.05W; Tolerance: ±5%; Package: 0201; HelpURL: https://www.digikey.com/product-detail/en/yageo/RC0201JR-07100RL/311-100NCT-ND/1949006; Temperature: -55...+125°C
R42 R83 = Resistor: Manufacturer: Yageo; PartNumber: RC0201JR-07100RL; ValueManufacturerPartNumber: Resistor film, 2k8, ±5%, 0201, 0.05W, -55...+125°C; TypeResistor: Resistor film; Power: 0.05W; Tolerance: ±5%; Package: 0201; HelpURL: https://www.digikey.com/product-detail/en/yageo/RC0201JR-07100RL/311-100NCT-ND/1949006; Temperature: -55...+125°C
R46 R84 = Resistor: Manufacturer: Yageo; PartNumber: RC0201JR-07100RL; ValueManufacturerPartNumber: Resistor film, 2k2, ±5%, 0201, 0.05W, -55...+125°C; TypeResistor: Resistor film; Power: 0.05W; Tolerance: ±5%; Package: 0201; HelpURL: https://www.digikey.com/product-detail/en/yageo/RC0201JR-07100RL/311-100NCT-ND/1949006; Temperature: -55...+125°C
R55 = Resistor: Manufacturer: Yageo; PartNumber: RC0201JR-07100RL; ValueManufacturerPartNumber: Resistor film, 100k, ±5%, 0201, 0.05W, -55...+125°C; TypeResistor: Resistor film; Power: 0.05W; Tolerance: ±5%; Package: 0201; HelpURL: https://www.digikey.com/product-detail/en/yageo/RC0201JR-07100RL/311-100NCT-ND/1949006; Temperature: -55...+125°C
SB1 = Button_tactile: Manufacturer: TE Connectivity; ValueManufacturerPartNumber: Tactile button, 6x6mm; PartNumber: FSM2JSMAATR; TypeButton: Tactile button; CommentText: "Кнопка"; HelpURL: https://www.digikey.com/product-detail/en/te-connectivity-alcoswitch-switches/FSM2JSMAATR/450-1792-1-ND/3503931; Package: 6x6mm
T1 = BD140C: 80V 1.5A     50MHz (BD139); Manufacturer: STMicroelectronics; Vce: 45V; TYPE: Transistors; Power: 12.5W; Ft: 60MHz; Complementary: BD139C; h21e: 63-250; Part Number: *; Mount Type: TH; Publisher: Hefest; Manufacturer Alternate: *; Published: 28.09.2019; Supplier 1: Mouser; Supplier Part Number 1: *; RoHS: Y; Technology: pnp; Package: TO126; Ic: 1.5A; ComponentLink1Description: Datasheet Link; ComponentLink1URL: https://www.onsemi.com/pub/Collateral/BD136-D.PDF; Price: *; Part Number Alternate: *; Cob: *; Value: BD140C
T2 = BD139C: 80V 1.5A     50MHz (BD140); Manufacturer: STMicroelectronics; TYPE: Transistors; Power: 12.5W; Ft: 150MHz; Complementary: BD140C; h21e: 40-250; Part Number: *; Mount Type: TH; Publisher: Hefest; Manufacturer Alternate: *; Published: 28.09.2019; Supplier 1: Mouser; Supplier Part Number 1: *; RoHS: Y; Technology: npn; Package: TO126; Vce: 80V; Ic: 1.5A; ComponentLink1Description: Datasheet Link; ComponentLink1URL: https://www.onsemi.com/pub/Collateral/BD135-D.PDF; Price: *; Part Number Alternate: *; Cob: *; Value: BD139C
U1 U4 = ADM7150ARDZ-3.3: IC REG LINEAR 3.3V 800MA 8SOIC; Manufacturer: Analog Devices Inc; Accuracy Percentage: 1%; Capacitance: SKIP; Dropout Voltage: 0.6V; Library Path1: parts/IC_Analog_Devices_Inc_ADM7150ARDZ-3.3_eec.SchLib; Max Junction Temp: +150°C; Max Supply Voltage: 16V; Min Supply Voltage: 4.5V; Nominal Supply Current: 8.6mA; Number Of Outputs: 1; Standoff Height: 0.05mm; Value: SKIP; Verification Version: 0.0.0.1; Part Number: ADM7150ARDZ-3.3; Datasheet Path: datasheets/IC_Analog_Devices_Inc_ADM7150ARDZ-3.3_eec.pdf; Ambient Temperature Range High: +125°C; Ambient Temperature Range Low: -40°C; ComponentLink1Description: Upverter; ComponentLink1URL: https://upverter.com/upn/revision/462e4a23285522a3/; ComponentLink2Description: Datasheet; ComponentLink2URL: http://www.analog.com/media/en/technical-documentation/data-sheets/ADM7150.pdf; Datasheet Path1: datasheets/IC_Analog_Devices_Inc_ADM7150ARDZ-3.3_eec.pdf; Digikey Description: IC REG LINEAR 3.3V 800MA 8SOIC; Digikey Part Number: ADM7150ARDZ-3.3-ND; Height: 1.75mm; Inductance: SKIP; Ipc Land Pattern Name: SOIC127P600X155-8; Lead Free: yes; Library Ref1: ADM7150ARDZ-3.3; Mouser Description: LDO Voltage Regulators 800mA ULN LDO 3.3Vo; Mouser Part Number: 584-ADM7150ARDZ-3.3; Output Current: 800mA; Output Voltage: 3.3V; Package: RD-8-2; Price: 6.70290578782; Resistance: SKIP; RoHS: TRUE; Supplier 1: Digi-Key; Supplier 2: Mouser; Supplier Part Number 1: ADM7150ARDZ-3.3-ND; Supplier Part Number 2: 584-ADM7150ARDZ-3.3; Temperature: -40°C to +125°C; Temperature Range High: +125°C; Temperature Range Low: -40°C; Voltage: SKIP; helpURL: https://upverter.com/upn/revision/462e4a23285522a3/
U2 = STM32F103CBT6TR: ARM Cortex-M3 32-bit MCU, 128 KB Flash, 20 KB Internal RAM, 37 I/Os, 48-pin LQFP, -40 to 85 degC, Tape and Reel; Operating Frequency(F) (Processor speed) (MHz): 72; FLASH Size (Prog) (kB): 128; I/Os (High Current): 37; Internal RAM Size (kB): 20; Supply Voltage(Vcc) min (V): 2; A/D Converter: 2x12-bit (10 Channel); ComponentLink1Description: Manufacturer URL; ComponentLink2Description: Datasheet; Core: ARM Cortex-M3; Mounting Technology: Surface Mount; ComponentLink3URL: http://www.st.com/st-web-ui/static/active/en/resource/technical/document/datasheet/DM00058181.pdf; DatasheetVersion: Rev. 16; ComponentLink1URL: http://www.st.com/web/en/home.html; ComponentLink2URL: http://www.st.com/st-web-ui/static/active/en/resource/technical/document/datasheet/CD00161566.pdf; Packing: Tape and Reel; PackageDescription: 48-Pin Low Profile Quad Flat Package, 7 x 7 mm Body, 0.5 mm Pitch; ComponentLink3Description: Package Specification; PartNumber: STM32F103CBT6TR; PackageReference: LQFP48; PackageVersion: Rev. 6, 06/2013
U3 U5 U8 U13-U15 = AD797BRZ: Single Channel Low Noise Operational Amplifier, 8 MHz BW, 20 V/us SR, Industrial, 8-pin SOIC (R-8), Tube; Manufacturer: Analog Devices; Amplifiers Per Package: 1; Small Signal Bandwidth: 8MHz; V Span Min: 10V; Iq/Amp: 10.5mA; Input Bias Current: 250nA; V Span Max: 36V; Input Offset Voltage: 25uV; Slew Rate: 20V/us; PartNumber: AD797BRZ; Generic Part Number: AD797; ComponentLink1Description: Manufacturer URL; ComponentLink2Description: Datasheet; DatasheetVersion: Rev. H; ComponentLink3URL: http://www.analog.com/static/imported-files/packages/PKG_PDF/SOIC_Narrow%20(R)/R_8.pdf; ComponentLink3Description: Package Specification; ComponentLink1URL: http://www.analog.com/en/index.html; Code_JEDEC: MS-012-AA; ComponentLink2URL: http://www.analog.com/static/imported-files/data_sheets/AD797.pdf; PackageVersion: 060506-A; Mounting Technology: Surface Mount; PackageReference: R-8; PackageDescription: 8-Pin Standard Small Outline Package, Body 3.9 x 4.9 mm, Pitch 1.27 mm
U6 U9 = LM317AT/NOPB_v: 3-Terminal Regulator 1=Adj 2=OUT 3=IN; Part Description: 3-Terminal High-Voltage 1.2V To 37V 1.5A Positive Adjustable Regulator; Manufacturer: TEXAS INSTRUMENTS; PressFit: No; Bonding: No; Part Number: LM317AT/NOPB_v; Component Kind: Standard; Component Type: Standard; Device: LM317; PackageDescription: TO-220 3-Terminal - Vertical Mount; Manufacturer Part Number: LM317AT/NOPB; Pin Count: 3; Case: TO-220; Mounted: Yes; Socket: No; SMD: No; Sense: No; ComponentHeight: 19.55mm; HelpURL: \\cern.ch\dfs\Applications\Altium\Datasheets\LM317AT-NOPB.pdf; Author: CERN DEM JLC; CreateDate: 07.12.2010; LatestRevisionDate: 18.09.2014
U7 U12 = AD1955ARSZ: High Performance Multibit Sigma-Delta DAC with SACD Playback, 5 V Power Supply, -40 to 85 degC, 28-Pin SSOP (RS-28), RoHS, Tube; Manufacturer: Analog Devices; Voltage Supply (V): 5; Max Sampling Rate (KHz): 192; DAC THD+N @ 1 kHz (-3dB): 110; Resolution (Bits): 24; # DAC: 2; DAC DNR (dB): 123; DAC Architecture: Sigma Delta; PartNumber: AD1955ARSZ; ComponentLink1Description: Manufacturer URL; ComponentLink2Description: Datasheet; DatasheetVersion: Rev. 0; ComponentLink1URL: http://www.analog.com/; Packing: Tube; ComponentLink2URL: http://www.analog.com/static/imported-files/data_sheets/AD1955.pdf; PackageReference: RS-28; ComponentLink3Description: Package Specification; Temperature Range (degC): -40 to 85; PackageVersion: 060106-A; RoHS: TRUE; Mounting Technology: Surface Mount; PackageDescription: 28-Pin Shrink Small Outline Package, Body 10.2 x 5.3 mm, Pitch 0.65 mm; ComponentLink3URL: http://www.analog.com/static/imported-files/packages/32122249223724RS_28.pdf
VD1-VD12 = Schottky_single: Manufacturer: Diodes Incorporated; ValueManufacturerPartNumber: Schottky diode, 80V, 500mA, 1V, 15pF, SOD-123, -55...+150°C; TypeDiode: Schottky diode; Voltage: 80V; Current: 500mA; VoltageDrop: 1V; RecoveryTime: 15pF; Package: SOD-123; HelpURL: https://www.digikey.com/product-detail/en/diodes-incorporated/MBR0580S1-7/MBR0580S1-7DICT-ND/5080371; Temperature: -55...+150°C
VT1 = BJT_NPN_132: Manufacturer: ON Semiconductor; ValueManufacturerPartNumber: NPN transistor, 45V, 100mA, 100MHz, 300mW, 0.6V, 420, SOT-23, -55...+125°C; PartNumber: BC847CLT1G; TypeTransistor: NPN transistor; VoltageCE: 45V; CurrentCE: 100mA; VoltageSaturation: 0.6V; Frequency: 100MHz; CurrentGain: 420; MaxPower: 300mW; Package: SOT-23; HelpURL: https://www.digikey.com/product-detail/en/on-semiconductor/BC847CLT1G/BC847CLT1GOSCT-ND/917836; Temperature: -55...+125°C